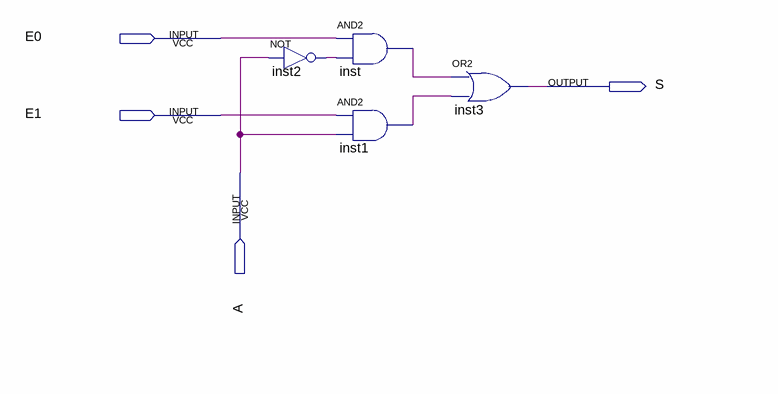
[diagram p0: schematic sheet]
// Quartus schematic mux.bdf as structural Verilog: 4 symbols, 4 pins
module mux (
  input  E0,
  input  E1,
  input  A,
  output S
);

  wire inst1_out, inst2_out, inst_out;

  and inst (inst_out, E0, inst2_out);
  not inst2 (inst2_out, A);
  and inst1 (inst1_out, E1, A);
  or inst3 (S, inst_out, inst1_out);
endmodule
